# Altium project electrode_module3.3.PrjPcb
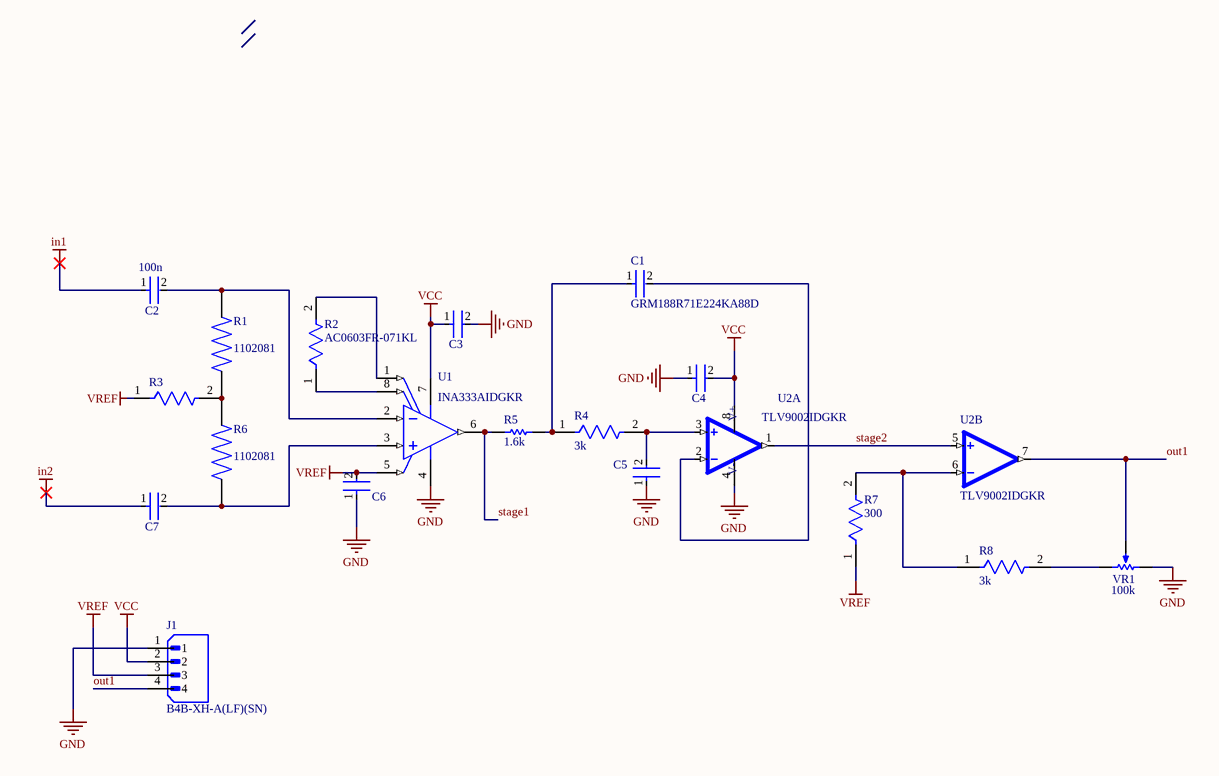
[diagram p0: electrode_module3.3.SchDoc]
1 sheet, 19 parts. Net scope: global (net labels, ports and power ports of the same name join across sheets).
Board file: Iter2.PcbDoc

## Sheet electrode_module3.3.SchDoc
size 297 x 209 mm

### Parts
C1  GRM188R71E224KA88D  [FP-GRM188-0_1-e0_2_0_5-IPC_C]
C2  100n  [FP-CGA3E-0_3-0_1-IPC_A]
C3  CGA3E2X7R1H104K080AA  [FP-CGA3E-0_3-0_1-IPC_A]  (value not drawn)
C4  CGA3E2X7R1H104K080AA  [FP-CGA3E-0_3-0_1-IPC_A]  (value not drawn)
C5  CGA3E2X7R1H104K080AA  [FP-CGA3E-0_3-0_1-IPC_A]  (value not drawn)
C6  CGA3E2X7R1H104K080AA  [FP-CGA3E-0_3-0_1-IPC_A]  (value not drawn)
C7  100n  [FP-CGA3E-0_3-0_1-IPC_A]  (value not drawn)
J1  B4B-XH-A(LF)(SN)  [JST_B4B-XH-A(LF)(SN)]
R1  Supplier Part Number 1: 1102081  [RESC1608X55N]  (hidden comment: RT0603BRD071ML)
R2  AC0603FR-071KL  [FP-AC0603-IPC_B]
R3  ERA-3AEB103V  [FP-ERA3A-IPC_C]  (value not drawn)
R4  3k  [FP-CRCW0603-e3-MFG]
R5  1.6k  [RESC1609X50X30LL10T20]
R6  Supplier Part Number 1: 1102081  [RESC1608X55N]  (hidden comment: RT0603BRD071ML)
R7  300  [FP-CRCW0603-e3-IPC_A]
R8  3k  [FP-CRCW0603-e3-MFG]
U1  INA333AIDGKR  [DGK0008A_N]
U2  TLV9002IDGKR  [SOP65P490X110-8N]  (parts A,B of 2)
VR1  100k  [BOUR-3362P]

### Nets
GND: C3.2 C4.1 C5.1 C6.1 J1.1 U1.4(V-) U2.4(V-) VR1.1(CCW)
in1: C2.1
in2: C7.1
VCC: C3.1 C4.2 J1.2 U1.7(V+) U2.8(V+)
VREF: C6.2 J1.3 R3.1 R7.1 U1.5(REF)
out1: J1.4 U2.7(OUT2) VR1.2(S)
stage1: R5.2 U1.6(VOUT)
stage2: U2.1(OUT1) U2.5(IN2+)
NetC1_1: C1.1 R4.1 R5.1
NetC1_2: C1.2 U2.2(IN1-)
NetC2_2: C2.2 R1.2 U1.2(VIN-)
NetC5_2: C5.2 R4.2 U2.3(IN1+)
NetC7_2: C7.2 R6.1 U1.3(VIN+)
NetR1_1: R1.1 R3.2 R6.2
NetR2_1: R2.1 U1.8(RG)
NetR2_2: R2.2 U1.1(RG)
NetR7_2: R7.2 R8.1 U2.6(IN2-)
NetR8_2: R8.2 VR1.3(CW)

### Notes on the sheet
- 1
- 2
- 3
- 4
- 5
- 6
- A
- B
- C
- D
- Title:
- File: electrode_module3.3.kicad_sch
- Sheet: /
- KiCad E.D.A.  kicad (5.1.4)-1
- Size: A4
- Date:
- Rev:
- Id: 1/1

### Library data of the parts
C1 = CMP-1035-02648-3: Chip Multilayer Ceramic Capacitors for General Purpose, 0603, 0.22uF, X7R, 15%, 10%, 25V; Voltage: 50V; Capacitance: 220nF; Number of Pins: 2; Length: 1.6mm; Material: Ceramic; Depth: 0.8mm; REACH SVHC: No SVHC; Voltage Rating (DC): 25V; Tolerance: 10%; Max Operating Temperature: 125°C; Lead Free: Lead Free; Package Quantity: 1; Voltage Rating: 25V; Width: 0.8mm; Case Code (Metric): 1608; Min Operating Temperature: -55°C; Case/Package: 0603; Mount: Surface Mount; Dielectric: X7R; Height: 0.8mm; Termination: SMD/SMT; Radiation Hardening: No; Case Code (Imperial): 0603; Thickness: 0.035inch; Packaging: Tape and Reel
C2-C7 = CMP-2000-07546-2: Cap Ceramic 100nF 50V X7R 10% Pad SMD 0603 +125°C Automotive T/R; Weight: 7.1E-05oz; Composition: Ceramic; Max Operating Temperature: 125°C; Termination: SMD/SMT; Dielectric: X7R; Length: 1.6mm; Package Quantity: 1; REACH SVHC: No SVHC; Lead Free: Lead Free; Case Code (Metric): 1608; Min Operating Temperature: -55°C; Packaging: Tape and Reel; Tolerance: 10%; Voltage Rating: 50V; Case Code (Imperial): 0603; Capacitance: 100nF; Case/Package: 0603; Voltage Rating (DC): 50V; Depth: 0.8mm; Radiation Hardening: No; Ratings: AEC-Q200; Mount: Surface Mount; Voltage: 50V; Thickness: 0.035inch; Width: 0.8mm; Height: 0.8mm
J1 = B4B-XH-A(LF)(SN): Connector Header Through Hole 4 position 0.098 (2.50mm); MF: JST Sales; SnapEDA_Link: https://www.snapeda.com/parts/B4B-XH-A(LF)(SN)/JST+Sales+America+Inc./view-part/?ref=snap; Package: None; Value: *; MP: B4B-XH-A(LF)(SN); Check_prices: https://www.snapeda.com/parts/B4B-XH-A(LF)(SN)/JST+Sales+America+Inc./view-part/?ref=eda
R1 R6 = RT0603BRD071ML: 1 MOhms Â±0.1% 0.1W, 1/10W Chip Resistor 0603 (1608 Metric) Thin Film; MF: Yageo; SnapEDA_Link: https://www.snapeda.com/parts/RT0603BRD071ML/Yageo/view-part/988154/?ref=snap; Purchase-URL: https://pricing.snapeda.com/search/part/RT0603BRD071ML/?ref=eda; MP: RT0603BRD071ML; Value: *; Package: 1608 Yageo; Digi-Key_Part_Number: YAG4498CT-ND; Check_prices: https://www.snapeda.com/parts/RT0603BRD071ML/Yageo/view-part/988154/?ref=eda; Supplier 1: Future Electronics
R2 = CMP-2000-04828-3: RES 1kΩ 1.00% 0.1W 0603; Voltage Rating: 50V; Power Rating: 100mW; Tolerance: 1%; Temperature Coefficient: 100ppm/°C; Resistance: 1kR; Depth: 0.8mm; Case/Package: 0603; Size Code: 0603; Case Code (Metric): 1608; Height: 0.022inch; Series: AC; Width: 0.031inch; Construction: Rectangular; Length: 0.063inch; Case Code (Imperial): 0603; Package Quantity: 1; RoHS Compliant: Yes; Features: Moisture Resistant; Resistor Type: Thick Film; Max Power Dissipation: 100mW; Packaging: Tape and Reel; Termination: SMD/SMT; Ratings: AEC-Q200; Max Operating Temperature: 155°C; Min Operating Temperature: -55°C; Military Standard: Not; Lead Free: Lead Free; Number of Terminations: 2
R3 = CMP-2000-00874-2: RES SMD 10K OHM 0.1% 1/10W 0603; Voltage Rating (DC): 75V; Power Rating: 100mW; Resistance: 10kR; Temperature Coefficient: 25ppm/°C; Radiation Hardening: No; Width: 0.8mm; Depth: 0.8mm; Construction: Rectangular; Case Code (Metric): 1608; Package Quantity: 5000; Length: 1.6mm; Size Code: 0603; Case Code (Imperial): 0603; Termination: SMD/SMT; Contact Plating: Tin; Resistance Tolerance: 0.1%; Military Standard: Not; Packaging: Tape and Reel; Max Power Dissipation: 100mW; REACH SVHC: No SVHC; Series: ERA-3A; Voltage Rating: 75V; Lead Free: Lead Free; Technology: METAL FILM; RoHS Compliant: Yes; Max Operating Temperature: 155°C; Resistor Type: Thin Film; Min Operating Temperature: -55°C; Number of Pins: 2; Case/Package: 0603; Tolerance: 0.1%; Height: 0.45mm; Mount: Surface Mount; Number of Terminations: 2
R4 R8 = CMP-2000-03293-2: RES Thick Film, 3kΩ, 1%, 0.1W, 100ppm/°C, 0603; Voltage Rating: 75V; Resistance: 3kR; Power Rating: 100mW; Features: Automotive AEC-Q200; Radiation Hardening: No; Contact Plating: Tin; Termination: SMD/SMT; Lead Free: Lead Free; Case Code (Imperial): 0603; Case Code (Metric): 1608; Case/Package: 0603; Depth: 0.85mm; Mount: Surface Mount; Voltage Rating (DC): 75V; Tolerance: 1%; Package Quantity: 10; Temperature Coefficient: 100ppm/°C; Height: 0.45mm; Max Power Dissipation: 100mW; Composition: Thick Film; Max Operating Temperature: 155°C; Military Standard: Not; Weight: 7.1E-05oz; Length: 1.55mm; Packaging: Tape and Reel; Number of Terminations: 2; Width: 0.85mm; Min Operating Temperature: -55°C
R5 = CMP-2000-03000-1: Part Number: CRCW06031K60FKEA; Manufacturer: Vishay Dale
R7 = CMP-2000-03216-2: RES Thick Film, 300Ω, 1%, 0.1W, 100ppm/°C, 0603; Voltage Rating (DC): 75V; Power Rating: 100mW; Resistance: 300R; Length: 1.55mm; Height: 0.45mm; Case/Package: 0603; Temperature Coefficient: 100ppm/°C; Packaging: Tape and Reel; Termination: SMD/SMT; Depth: 0.85mm; Max Operating Temperature: 155°C; Radiation Hardening: No; Tolerance: 1%; Lead Free: Lead Free; Case Code (Metric): 1608; Voltage Rating: 75V; Weight: 7.1E-05oz; Package Quantity: 10; Military Standard: Not; Case Code (Imperial): 0603; Composition: Thick Film; Min Operating Temperature: -55°C; Width: 0.033inch; Number of Terminations: 2; Mount: Surface Mount; Features: Automotive AEC-Q200; Contact Plating: Tin; Max Power Dissipation: 100mW
U1 = CMP-0944-00088-2: Low Power, Precision Instrumentation Amplifier, -40 to 125 degC, 8-pin SOP (DGK8), Green (RoHS & no Sb/Br); Manufacturer: Texas Instruments; Input Offset Drift (+/-)(Max)(uV/Degrees Celsius): 0.1; Vs(Max)(V): 5.5; Input Bias Current (+/-)(Max)(nA): 0.2; Output Offset (+/-)(Max)(uV): 75/G; CMRR(Min)(dB): 100; Noise at 1kHz(Typ)(nV/rt(Hz)): 50; Output Offset Drift (+/-)(Max)(uV/Degrees Celsius): 0.5/G; Vs(Min)(V): 1.8; Quiescent Current (+/-)(Typ)(mA): 0.05; Gain(V/V): 1 to 1000; SubFamily: Single Supply; Number of Channels: 1; Input Offset (+/-)(Max)(uV): 25; Code_JEDEC: MO-187; Eco-Plan: Green (RoHS & no Sb/Br); ComponentLink2URL: http://www.ti.com/general/docs/lit/getliterature.tsp?genericPartNumber=INA333&fileType=pdf; Mounting Technology: Surface Mount; PartNumber: INA333AIDGKR; ComponentLink3URL: http://www.ti.com/litv/pdf/mpds028d; ComponentLink1URL: http://www.ti.com/; DatasheetVersion: SBOS445B; ComponentLink2Description: Datasheet; PackageVersion: 4073329/E, 05/2006; PackageReference: DGK0008A; ComponentLink3Description: Package Specification; PackageDescription: 8-Pin Thin Small Outline, Body 3 x 3 mm, Pitch 0.65 mm; ComponentLink1Description: Manufacturer URL
U2 = TLV9002IDGKR: Dual, 5.5-V, 1-MHz, RRIO operational amplifier for cost-optimized applications; MF: Texas Instruments; SnapEDA_Link: https://www.snapeda.com/parts/TLV9002IDGKR/Texas+Instruments/view-part/?ref=snap; Package: VSSOP-8 Texas Instruments; Value: *; MP: TLV9002IDGKR; Check_prices: https://www.snapeda.com/parts/TLV9002IDGKR/Texas+Instruments/view-part/?ref=eda
VR1 = CMP-1747-00003-1: Square Trimpot(R) Trimming Potentiometer, 100 KOhm, 300 V, -55 to 125 degC, 3-Pin THD, RoHS, Tube; Voltage Rating: 250 V; Case\Package: Axial; Tolerance: 1%; Power Rating: 250 mW; Resistance: 1 mohm; RoHSCompliant: true; ComponentLink2URL: http://www.bourns.com/docs/Product-Datasheets/3362.pdf; ComponentLink1Description: Manufacturer URL; DatasheetVersion: May-16; Package Quantity: 200; ComponentLink2Description: Datasheet; Min Operating Temperature: -55 degC; Mount: Through Hole; PackageDescription: 3-Pin Through Hole Device, Body 6.6 x 6.99 mm, Pitch 2.54 mm; Length: 0.248 inch; ComponentLink1URL: http://www.bourns.com/; PackageReference: 3326P; Max Operating Temperature: 155 degC; Packaging: Bulk